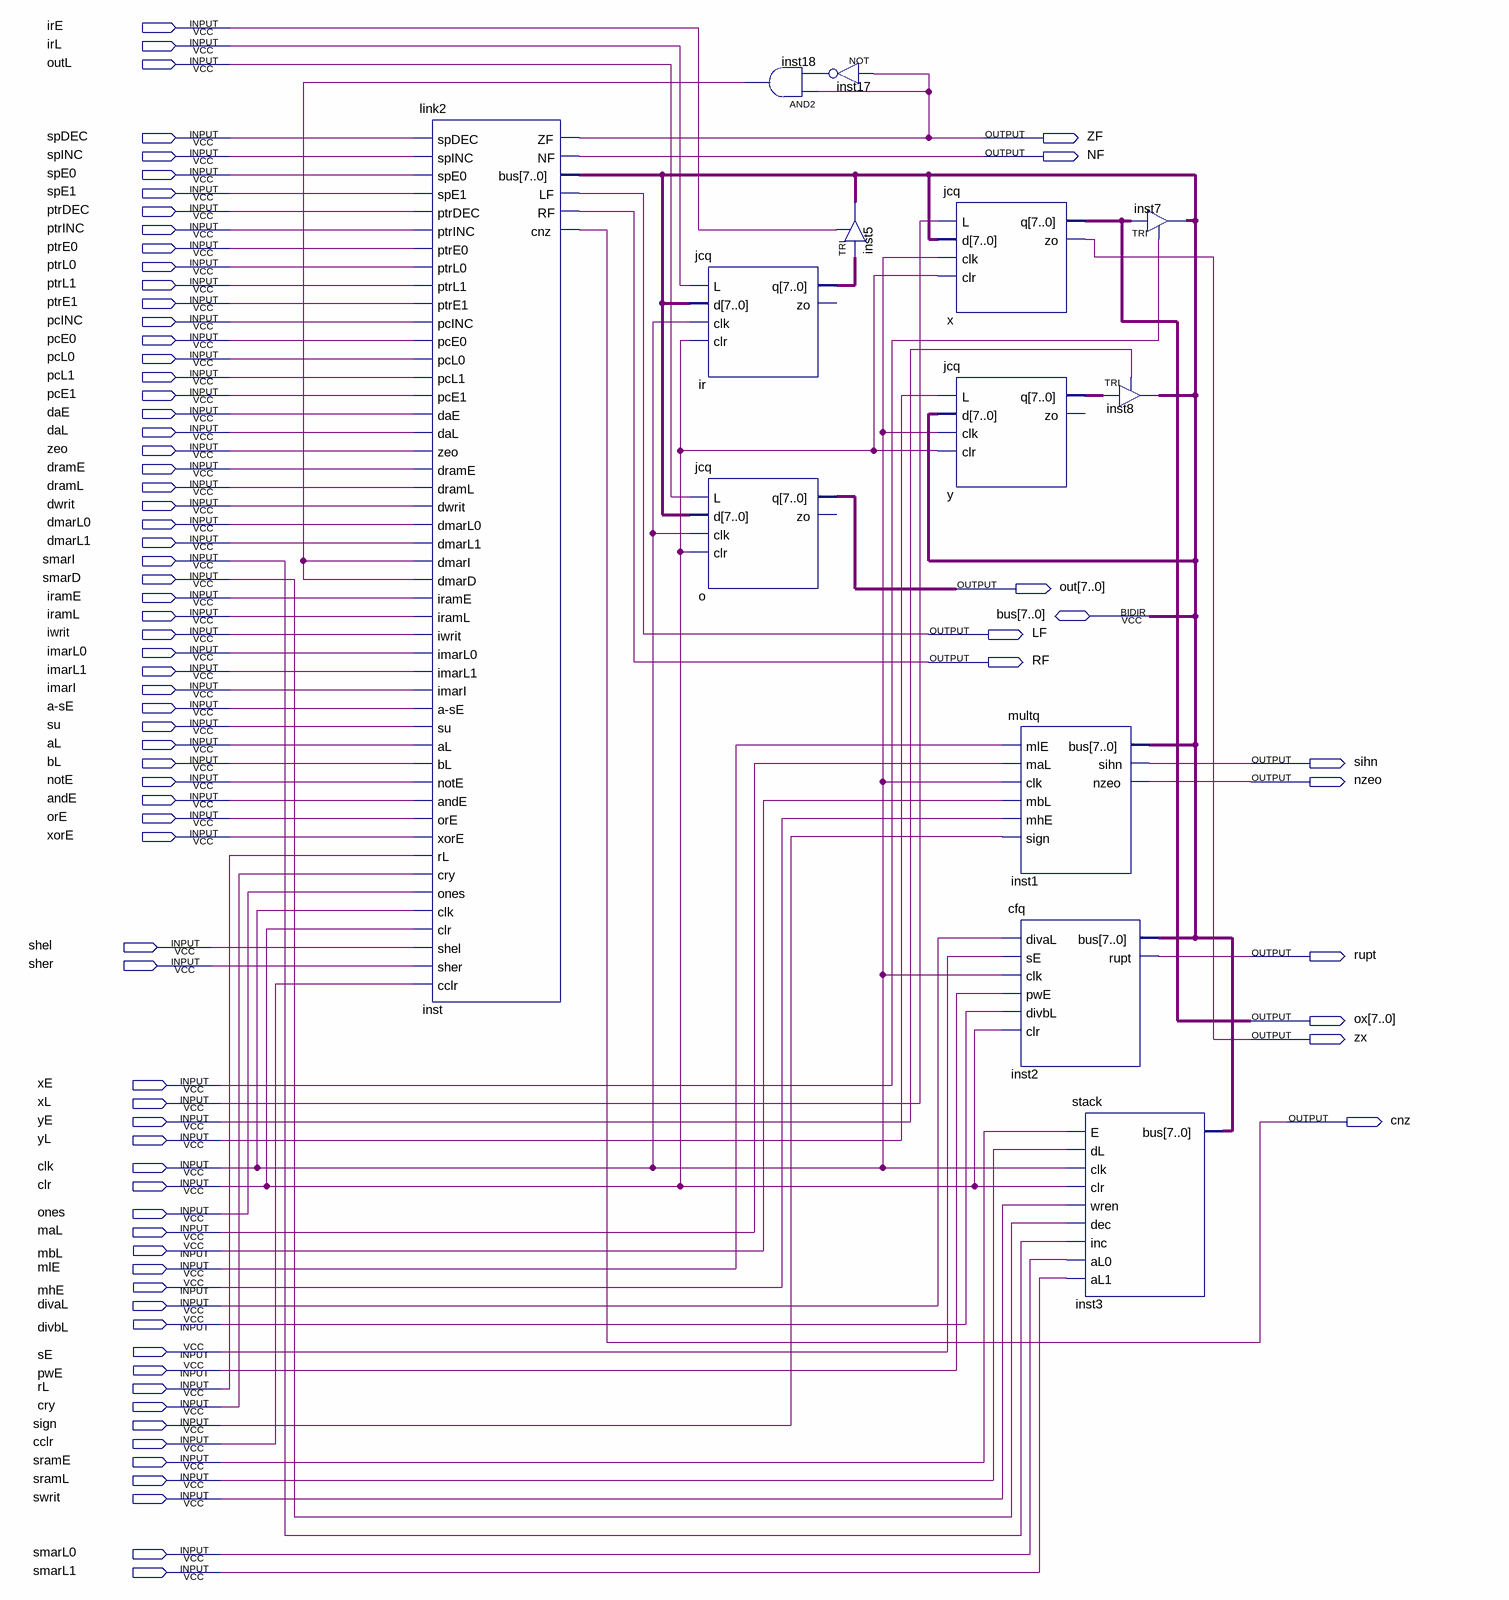
[diagram p0: schematic sheet]
// Quartus schematic link3.bdf as structural Verilog: 13 symbols, 80 pins
module link3 (
  input  irE,
  input  irL,
  input  outL,
  input  spDEC,
  input  spINC,
  input  spE0,
  input  spE1,
  input  ptrDEC,
  input  ptrINC,
  input  ptrE0,
  input  ptrL0,
  input  ptrL1,
  input  ptrE1,
  input  pcINC,
  input  pcE0,
  input  pcL0,
  input  pcL1,
  input  pcE1,
  input  daE,
  input  daL,
  input  zeo,
  input  dramE,
  input  dramL,
  input  dwrit,
  input  dmarL0,
  input  dmarL1,
  input  smarI,
  input  smarD,
  input  iramE,
  input  iramL,
  input  iwrit,
  input  imarL0,
  input  imarL1,
  input  imarI,
  input  \a-sE ,
  input  su,
  input  aL,
  input  bL,
  input  notE,
  input  andE,
  input  orE,
  input  xorE,
  input  shel,
  input  sher,
  input  xE,
  input  xL,
  input  yE,
  input  yL,
  input  clk,
  input  clr,
  input  ones,
  input  maL,
  input  mbL,
  input  mlE,
  input  mhE,
  input  divaL,
  input  divbL,
  input  sE,
  input  pwE,
  input  rL,
  input  cry,
  input  sign,
  input  cclr,
  input  sramE,
  input  sramL,
  input  swrit,
  input  smarL0,
  input  smarL1,
  inout  [7:0] bus,
  output ZF,
  output NF,
  output [7:0] out,
  output LF,
  output RF,
  output sihn,
  output nzeo,
  output rupt,
  output [7:0] ox,
  output zx,
  output cnz
);

  wire inst17_out, inst18_out;
  wire [7:0] ir_q, y_q;

  link2 inst (
    .spDEC(spDEC), .spINC(spINC), .spE0(spE0), .spE1(spE1), .ptrDEC(ptrDEC), .ptrINC(ptrINC), .ptrE0(ptrE0),
    .ptrL0(ptrL0), .ptrL1(ptrL1), .ptrE1(ptrE1), .pcINC(pcINC), .pcE0(pcE0), .pcL0(pcL0), .pcL1(pcL1),
    .pcE1(pcE1), .daE(daE), .daL(daL), .zeo(zeo), .dramE(dramE), .dramL(dramL), .dwrit(dwrit),
    .dmarL0(dmarL0), .dmarL1(dmarL1), .dmarI(inst18_out), .dmarD(inst18_out), .iramE(iramE), .iramL(iramL),
    .iwrit(iwrit), .imarL0(imarL0), .imarL1(imarL1), .imarI(imarI), .\a-sE (\a-sE ), .su(su), .aL(aL),
    .bL(bL), .notE(notE), .andE(andE), .orE(orE), .xorE(xorE), .rL(rL), .cry(cry), .ones(ones), .clk(clk),
    .clr(clr), .shel(shel), .sher(sher), .cclr(cclr), .ZF(ZF), .NF(NF), .LF(LF), .RF(RF), .cnz(cnz), .bus(bus));
  jcq ir (.L(irL), .d(bus), .clk(clk), .clr(clr), .q(ir_q));  // open: zo
  jcq o (.L(outL), .d(bus), .clk(clk), .clr(clr), .q(out));  // open: zo
  and inst18 (inst18_out, ZF, inst17_out);
  not inst17 (inst17_out, ZF);
  TRI inst5[7:0] (.IN(ir_q), .OE(irE), .OUT(bus));
  jcq x (.L(xL), .d(bus), .clk(clk), .clr(clr), .q(ox), .zo(zx));
  jcq y (.L(yL), .d(bus), .clk(clk), .clr(clr), .q(y_q));  // open: zo
  multq inst1 (.mlE(mlE), .maL(maL), .clk(clk), .mbL(mbL), .mhE(mhE), .sign(sign), .sihn(sihn), .nzeo(nzeo), .bus(bus));
  cfq inst2 (.divaL(divaL), .sE(sE), .clk(clk), .pwE(pwE), .divbL(divbL), .clr(clr), .rupt(rupt), .bus(bus));
  TRI inst7[7:0] (.IN(ox), .OE(xE), .OUT(bus));
  TRI inst8[7:0] (.IN(y_q), .OE(yE), .OUT(bus));
  stack inst3 (
    .E(sramE), .dL(sramL), .clk(clk), .clr(clr), .wren(swrit), .dec(smarD), .inc(smarI), .aL0(smarL0),
    .aL1(smarL1), .bus(bus));
endmodule
